# EAGLE design PaddleClock-digitpad-v1 (EAGLE 5.06)
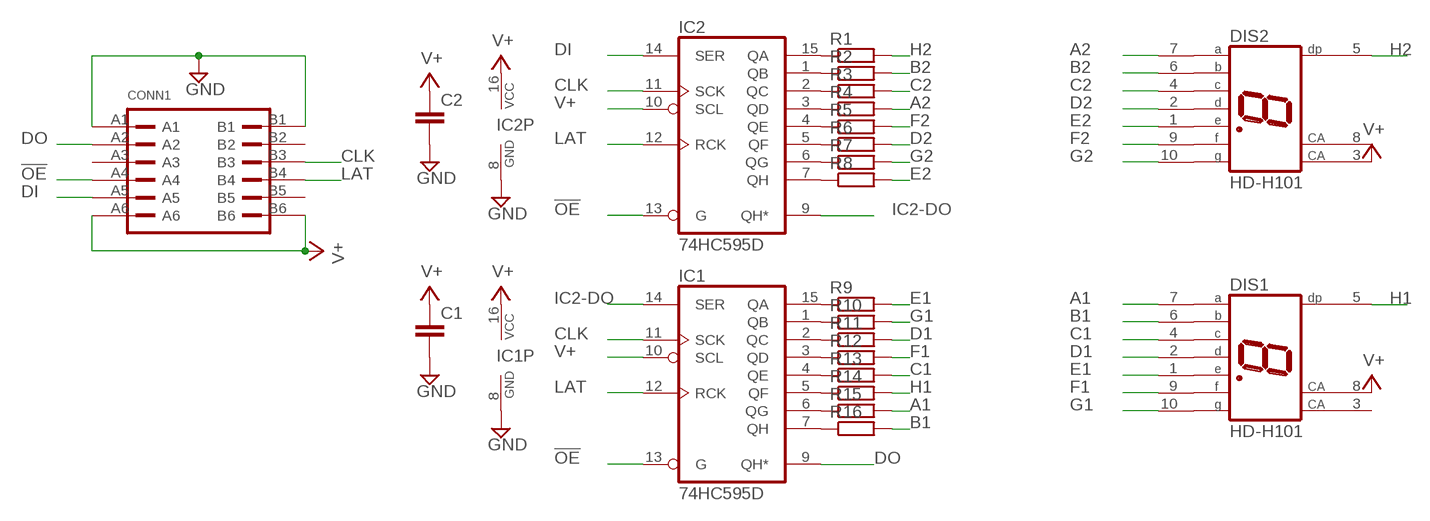
[diagram p0: schematic, sheet 1]

## Parts
C1  C-EU025-024X044  [C025-024X044]
C2  C-EU025-024X044  [C025-024X044]
CONN1  PCB_EDGE_CONNECTOR_6X2  [PCB_EDGE_CONNECTOR_6X2]
DIS1  HD-H101  [HDSP-M]
DIS2  HD-H101  [HDSP-M]
IC1  74HC595D  [SO16]
IC2  74HC595D  [SO16]
R1  R-EU_0204/5  [0204/5]
R2  R-EU_0204/5  [0204/5]
R3  R-EU_0204/5  [0204/5]
R4  R-EU_0204/5  [0204/5]
R5  R-EU_0204/5  [0204/5]
R6  R-EU_0204/5  [0204/5]
R7  R-EU_0204/5  [0204/5]
R8  R-EU_0204/5  [0204/5]
R9  R-EU_0204/5  [0204/5]
R10  R-EU_0204/5  [0204/5]
R11  R-EU_0204/5  [0204/5]
R12  R-EU_0204/5  [0204/5]
R13  R-EU_0204/5  [0204/5]
R14  R-EU_0204/5  [0204/5]
R15  R-EU_0204/5  [0204/5]
R16  R-EU_0204/5  [0204/5]

## Nets
!OE: CONN1.A4 IC1.13(G) IC2.13(G)
A1: DIS1.7(A) R15.2
A2: DIS2.7(A) R4.2
B1: DIS1.6(B) R16.2
B2: DIS2.6(B) R2.2
C1: DIS1.4(C) R13.2
C2: DIS2.4(C) R3.2
CLK: CONN1.B3 IC1.11(SCK) IC2.11(SCK)
D1: DIS1.2(D) R11.2
D2: DIS2.2(D) R6.2
DI: CONN1.A5 IC2.14(SER)
DO: CONN1.A2 IC1.9(QH*)
E1: DIS1.1(E) R9.2
E2: DIS2.1(E) R8.2
F1: DIS1.9(F) R12.2
F2: DIS2.9(F) R5.2
G1: DIS1.10(G) R10.2
G2: DIS2.10(G) R7.2
GND: C1.2 C2.2 CONN1.A1 CONN1.B1 IC1.8(GND) IC2.8(GND)
H1: DIS1.5(DP) R14.2
H2: DIS2.5(DP) R1.2
IC2-DO: IC1.14(SER) IC2.9(QH*)
LAT: CONN1.B4 IC1.12(RCK) IC2.12(RCK)
N$1: IC1.15(QA) R9.1
N$2: IC1.1(QB) R10.1
N$3: IC2.15(QA) R1.1
N$4: IC2.1(QB) R2.1
N$5: IC2.2(QC) R3.1
N$6: IC2.3(QD) R4.1
N$7: IC2.4(QE) R5.1
N$8: IC2.5(QF) R6.1
N$9: IC2.6(QG) R7.1
N$10: IC2.7(QH) R8.1
N$15: IC1.2(QC) R11.1
N$16: IC1.3(QD) R12.1
N$17: IC1.4(QE) R13.1
N$18: IC1.5(QF) R14.1
N$19: IC1.6(QG) R15.1
N$26: IC1.7(QH) R16.1
V+: C1.1 C2.1 CONN1.A6 CONN1.B6 DIS1.8(CA) DIS2.3(CA) IC1.10(SCL) IC1.16(VCC) IC2.10(SCL) IC2.16(VCC)
Unconnected: CONN1.A3 CONN1.B2 CONN1.B5 DIS1.3(CA) DIS2.8(CA)

## Library data of the parts
C1 C2 = rcl:C-EU: CAPACITOR, European symbol
CONN1 = dp_devices:PCB_EDGE_CONNECTOR_6X2
DIS1 DIS2 = display-hp:HD-H101: LED DISPLAY 1-character 7 segment, decimal point right
IC1 IC2 = 74xx-eu:74*595: 8-bit SHIFT REGISTER, output latch
R1-R16 = rcl:R-EU_: RESISTOR, European symbol

## Board
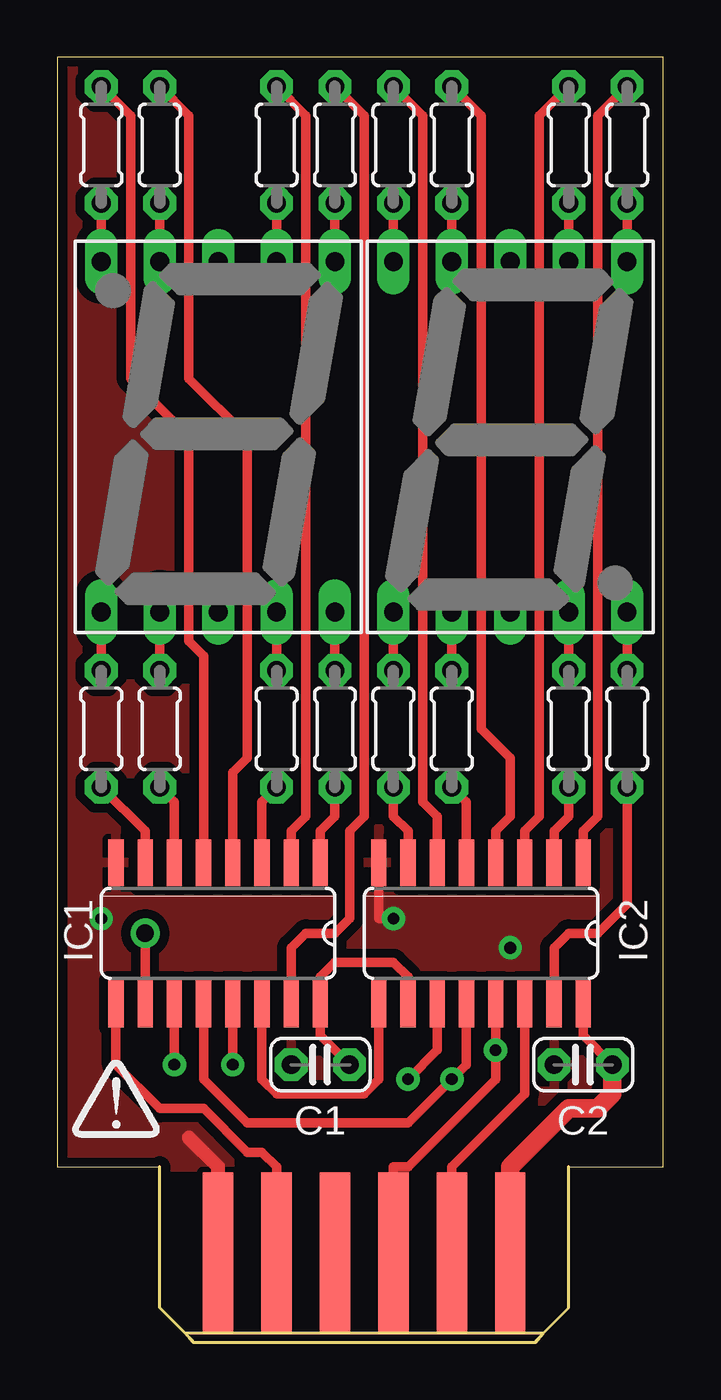
[diagram p1: board, top side]
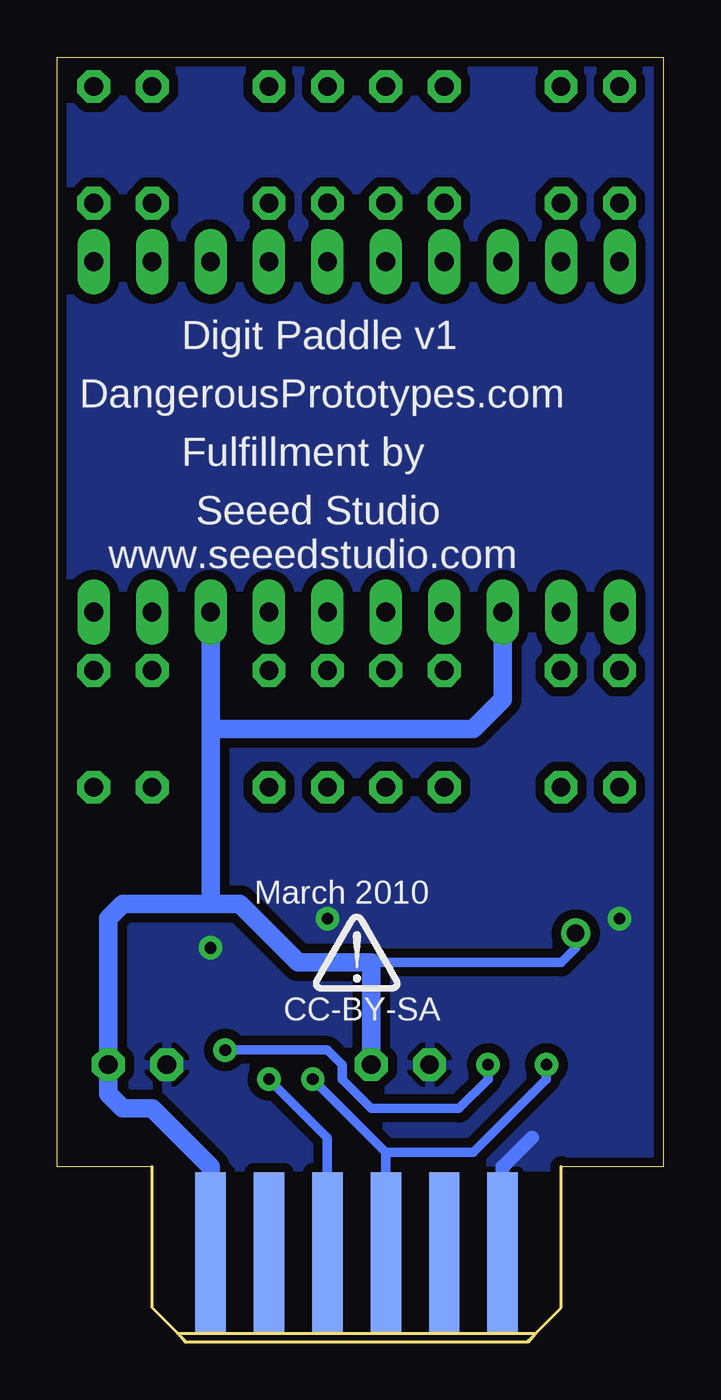
[diagram p2: board, bottom side, seen from below]

Size 26.34 x 55.87 mm. Coordinates in mm from the lower left corner, seen from the top.
Outline: 4.45,7.62 0,7.62 0,55.87 26.34,55.87 26.34,7.62 22.22,7.62
Copper layers (1*16): Top 0.035mm / dielectric 1.5mm / Bottom 0.035mm
Design rules "SparkFun": minimum track width 8mil, minimum drill 20mil, track to track 8mil, track to pad 8mil, pad to pad 8mil, via to via 8mil, smd to smd 8mil, copper to edge 10mil, drill to drill 8mil, minimum pad ring 12mil, minimum via ring 10mil, stop-mask expansion 4mil, vias tented up to drill 25mil, thermal gap 10mil

### Footprints (pad centres in the part's own frame; a part is rotated, then mirrored left to right if it is on the bottom)
C025-024X044 = drill 0.813 octagon: 1 -1.27,0; 2 1.27,0
PCB_EDGE_CONNECTOR_6X2 = smd 1.32 x 7: A1 -6.35,0.062; A2 -3.81,0.062; A3 -1.27,0.062; A4 1.27,0.062; A5 3.81,0.062; A6 6.35,0.062 | smd 1.32 x 7 bottom: B1 -6.35,0.062; B2 -3.81,0.062; B3 -1.27,0.062; B4 1.27,0.062; B5 3.81,0.062; B6 6.35,0.062
HDSP-M = drill 0.813 long: 1 -5.08,-7.62; 2 -2.54,-7.62; 3 0,-7.62; 4 2.54,-7.62; 5 5.08,-7.62; 6 5.08,7.62; 7 2.54,7.62; 8 0,7.62; 9 -2.54,7.62; 10 -5.08,7.62
SO16 = smd 0.66 x 2.032: 1 -4.445,-3.073; 2 -3.175,-3.073; 3 -1.905,-3.073; 4 -0.635,-3.073; 5 0.635,-3.073; 6 1.905,-3.073; 7 3.175,-3.073; 8 4.445,-3.073; 9 4.445,3.073; 10 3.175,3.073; 11 1.905,3.073; 12 0.635,3.073; 13 -0.635,3.073; 14 -1.905,3.073; 15 -3.175,3.073; 16 -4.445,3.073
0204/5 = drill 0.813 octagon: 1 -2.54,0; 2 2.54,0

### Placement (x,y rotation side)
C1  11.43,12.06 180 top
C2  22.86,12.06 180 top
CONN1  13.34,3.81 0 top
DIS1  6.99,39.37 180 top
DIS2  19.68,39.37 0 top
IC1  6.99,17.78 180 top
IC2  18.41,17.78 180 top
R1  24.76,26.67 90 top
R2  24.76,52.07 270 top
R3  22.22,26.67 90 top
R4  22.22,52.07 270 top
R5  17.14,52.07 270 top
R6  17.14,26.67 90 top
R7  14.61,52.07 270 top
R8  14.61,26.67 90 top
R9  12.06,52.07 270 top
R10  12.06,26.67 90 top
R11  9.53,52.07 270 top
R12  9.53,26.67 90 top
R13  4.45,52.07 270 top
R14  1.91,52.07 270 top
R15  4.45,26.67 90 top
R16  1.91,26.67 90 top
U$1  [DP-LOGO]  0.64,8.89 0 top
U$2  [DP-LOGO]  15.24,15.24 0 bottom

### Tracks (layer width: path | path; a pad name or v marks a point on that pad's centre or on a via)
!OE  (via drill 0.51 pad 1.02)
  Top 0.406: v7.62,12.06 IC1.13 | IC2.13 v19.05,12.7 19.05,11.43 15.24,7.62 14.61,7.62 CONN1.A4
  Bottom 0.406: v7.62,12.06 7.62,11.43 8.89,10.16 12.7,10.16 13.97,11.43 13.97,12.06 14.61,12.7 v19.05,12.7
A1
  Top 0.406: R15.2 DIS1.7
A2
  Top 0.406: DIS2.7 R4.2
B1
  Top 0.406: R16.2 DIS1.6
B2
  Top 0.406: DIS2.6 R2.2
C1
  Top 0.406: DIS1.4 R13.2
C2
  Top 0.406: R3.2 DIS2.4
CLK  (via drill 0.51, 0.51 pad 1.02)
  Top 0.406: v15.24,11.43 16.51,12.7 IC2.11 | v5.08,12.06 IC1.11
  Bottom 0.406: 12.06,8.26 v15.24,11.43 | 12.06,8.26 CONN1.B3 | 12.06,8.26 8.26,8.26 5.71,10.79 5.08,11.43 v5.08,12.06
D1
  Top 0.406: DIS1.2 R11.2
D2
  Top 0.406: R6.2 DIS2.2
DI
  Top 0.406: IC2.14 20.32,10.79 17.14,7.62 CONN1.A5
DO
  Top 0.406: IC1.9 2.54,12.06 4.45,10.16 6.35,10.16 8.26,8.26 8.89,8.26 9.53,7.62 CONN1.A2
E1
  Top 0.406: DIS1.1 R9.2
E2
  Top 0.406: R8.2 DIS2.1
F1
  Top 0.406: R12.2 DIS1.9
F2
  Top 0.406: DIS2.9 R5.2
G1
  Top 0.406: R10.2 DIS1.10
G2
  Top 0.406: DIS2.10 R7.2
GND  (via drill 0.51 pad 1.02)
  Top 0.406: IC2.8 13.97,18.41 v14.61,18.41
  Top 0.61: CONN1.B1 6.99,7.62 5.71,8.89
  Bottom 0.61: CONN1.B1 6.99,7.62 5.71,8.89
  other vias: 19.68,17.14 1.91,18.41
  pour Top (isolate 0.406): 0.64,55.88 26.04,55.88 26.04,7.62 22.22,7.62 0.64,7.62
  pour Bottom (isolate 0.406): -0.64,55.88 26.04,55.88 26.04,7.62 4.45,7.62 -0.64,7.62
H1
  Top 0.406: DIS1.5 R14.2
H2
  Top 0.406: R1.2 DIS2.5
IC2-DO
  Top 0.406: IC2.9 13.97,11.43 13.34,10.79 9.53,10.79 8.89,11.43 IC1.14
LAT  (via drill 0.51)
  Top 0.406: IC2.12 17.78,12.06 v17.14,11.43 15.24,9.53 8.26,9.53 6.35,11.43 IC1.12
  Bottom 0.406: v17.14,11.43 14.61,8.89 CONN1.B4
N$1
  Top 0.406: R9.1 13.34,53.34 13.34,22.86 12.7,22.22 12.7,18.41 12.06,17.78 10.79,17.78 10.16,17.14 IC1.15
N$2
  Top 0.406: IC1.1 11.43,22.22 12.06,22.86 R10.1
N$3
  Top 0.406: IC2.15 21.59,17.14 22.22,17.78 23.49,17.78 24.76,19.05 R1.1
N$4
  Top 0.406: IC2.1 22.86,22.22 23.49,22.86 23.49,53.34 R2.1
N$5
  Top 0.406: IC2.2 21.59,22.22 22.22,22.86 R3.1
N$6
  Top 0.406: IC2.3 20.32,22.22 20.95,22.86 20.95,53.34 R4.1
N$7
  Top 0.406: IC2.4 19.05,22.22 19.68,22.86 19.68,25.4 18.41,26.67 18.41,53.34 R5.1
N$8
  Top 0.406: IC2.5 17.78,23.5 R6.1
N$9
  Top 0.406: IC2.6 16.51,22.86 15.88,23.5 15.88,53.34 R7.1
N$10
  Top 0.406: IC2.7 15.24,22.22 14.61,22.86 R8.1
N$15
  Top 0.406: IC1.2 10.16,22.22 10.79,22.86 10.79,53.34 R11.1
N$16
  Top 0.406: IC1.3 8.89,23.5 R12.1
N$17
  Top 0.406: R13.1 5.71,53.34 5.71,41.91 8.26,39.37 8.26,25.4 7.62,24.77 IC1.4
N$18
  Top 0.406: IC1.5 6.35,29.84 5.71,30.48 5.71,39.37 3.17,41.91 3.17,53.34 R14.1
N$19
  Top 0.406: IC1.6 5.08,23.5 R15.1
N$26
  Top 0.406: IC1.7 3.81,22.22 R16.1
V+  (via drill 0.76)
  Top 0.406: C1.1 11.43,13.33 IC1.16 11.43,15.88 12.06,16.51 14.61,16.51 15.24,15.88 IC2.10 | IC2.16 22.86,13.33 C2.1 | IC1.10 v3.81,17.78
  Top 0.813: CONN1.A6 19.68,7.62 22.22,10.16 23.49,10.16 24.13,10.79 C2.1
  Bottom 0.406: v3.81,17.78 3.81,17.14 4.45,16.51 12.7,16.51
  Bottom 0.813: 19.68,19.05 19.68,26.67 | 19.68,26.67 DIS2.3 | DIS1.8 6.99,27.94 8.26,26.67 19.68,26.67 | 19.68,19.05 18.41,19.05 15.88,16.51 12.7,16.51 C1.1 | 19.68,19.05 23.49,19.05 24.13,18.41 C2.1 24.13,10.79 23.49,10.16 22.22,10.16 19.68,7.62 CONN1.A6

### Text on the board
bNames: Digit Paddle v1 | DangerousPrototypes.com | Fulfillment by | Seeed Studio | www.seeedstudio.com | March 2010 | CC-BY-SA